# EAGLE design pentabug (EAGLE 6.2)
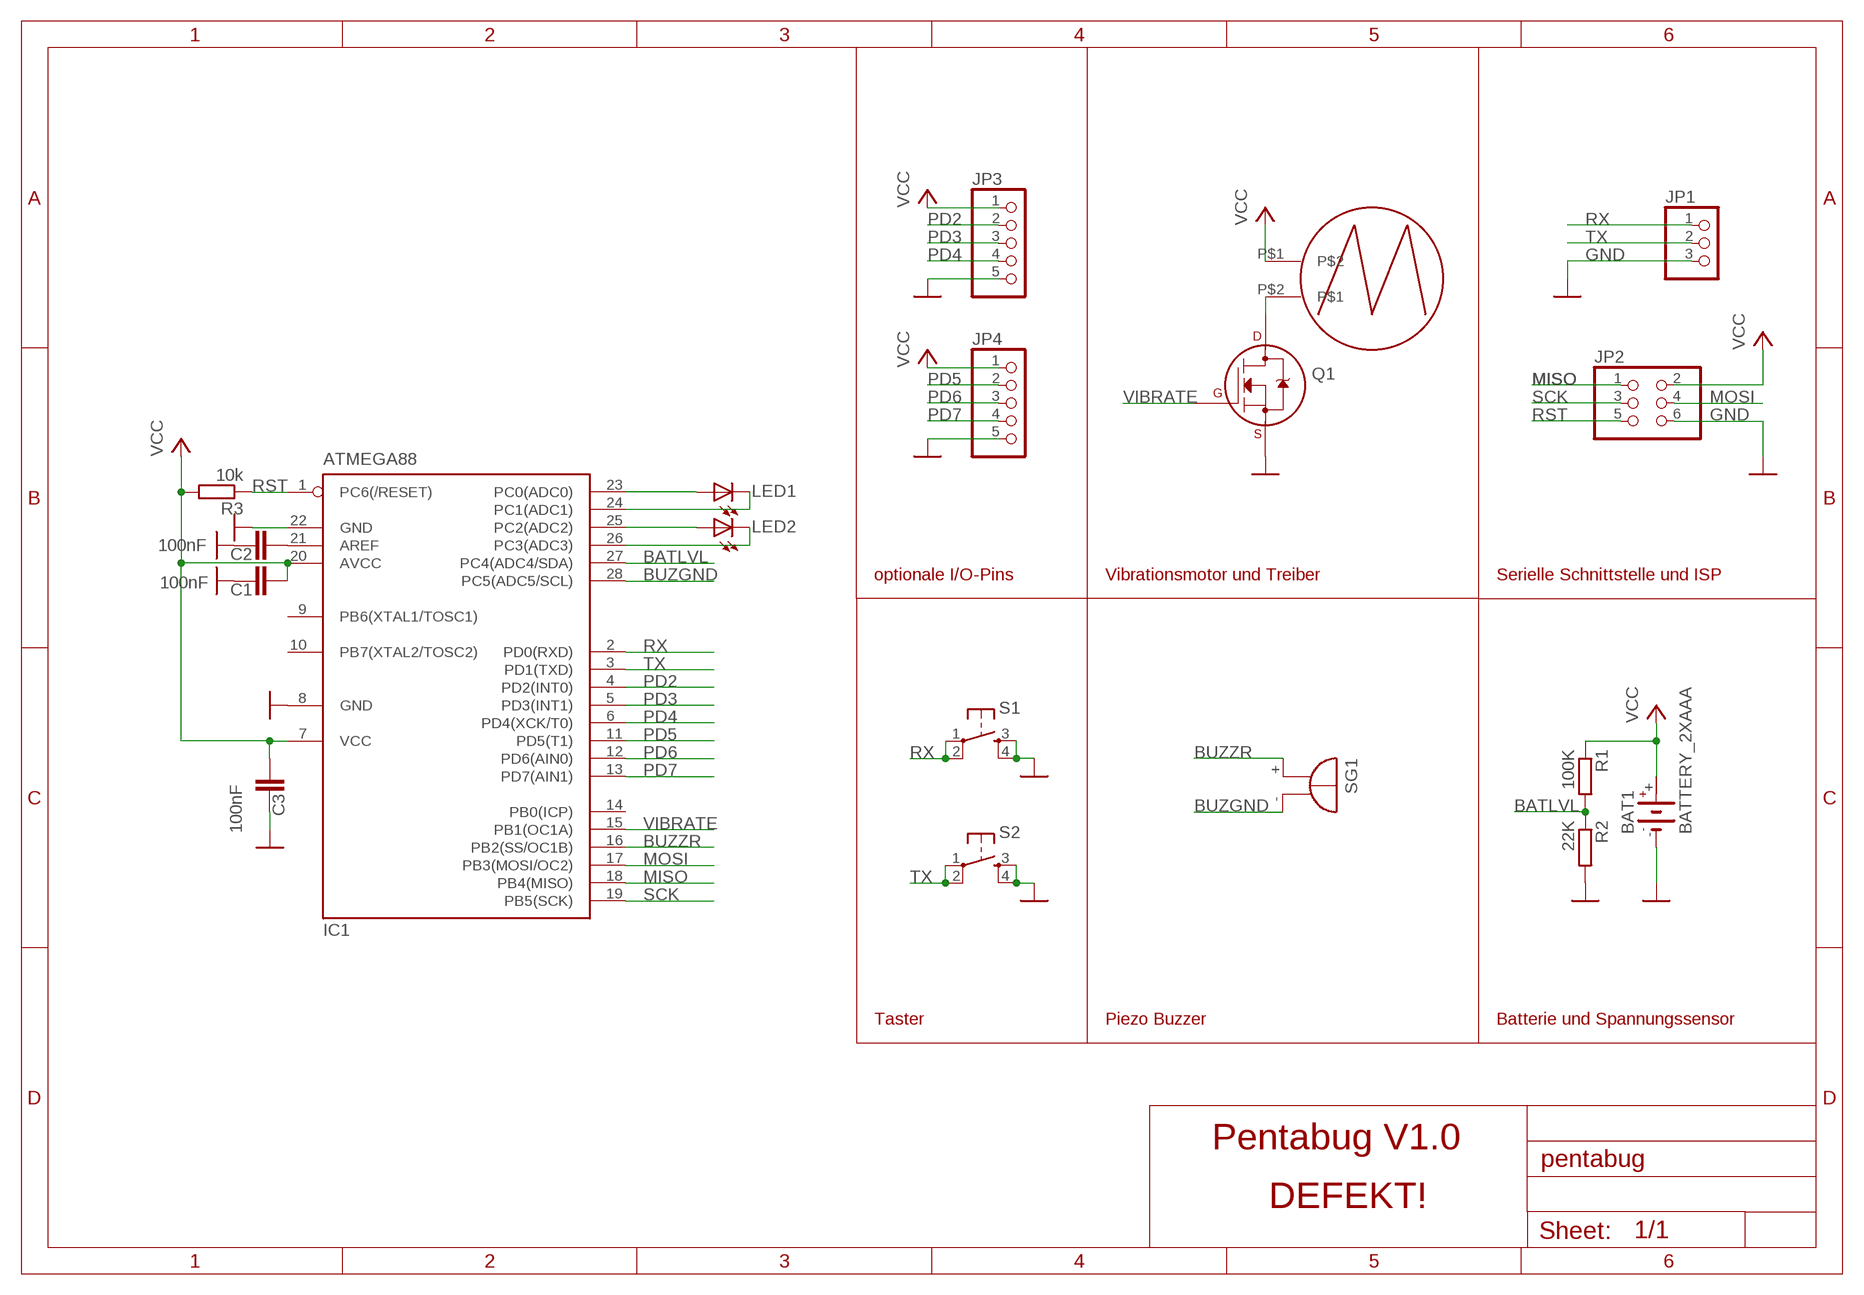
[diagram p0: schematic, sheet 1]

## Parts
BAT1  BATTERY_2XAAA  [BATTERY_2XAAA]
C1  100nF  C-EU025-024X044  [C025-024X044]
C2  100nF  C-EU025-024X044  [C025-024X044]
C3  100nF  C-EU025-024X044  [C025-024X044]
IC1  ATMEGA88  MEGA8-P  [DIL28-3]
JP1  PINHD-1X3  [1X03]
JP2  PINHD-2X3  [2X03]
JP3  PINHD-1X5  [1X05]
JP4  PINHD-1X5  [1X05]
LED1  LED5MM  [LED5MM]
LED2  LED5MM  [LED5MM]
Q1  2N7000_TO92  [TO-92]
R1  100K  R-EU_0207/10  [0207/10]
R2  22K  R-EU_0207/10  [0207/10]
R3  10k  R-EU_0207/10  [0207/10]
S1  TAC_SWITCHPTH  [TACTILE-PTH]
S2  TAC_SWITCHPTH  [TACTILE-PTH]
SG1  MULTIBUZZRTDKBUZZR  [BUZZRTDK]
U$1  VIBRAMOTOR  [LA4-432]

## Nets
BATLVL: IC1.27(PC4(ADC4/SDA)) R1.2 R2.1
BATTLVL: IC1.26(PC3(ADC3)) LED2.K(C)
BUZGND: IC1.28(PC5(ADC5/SCL)) SG1.-
BUZZR: IC1.16(PB2(SS/OC1B)) SG1.+
GND: BAT1.- C1.1 C2.1 C3.1 IC1.8(GND) IC1.22(GND) JP1.3 JP2.6 JP3.5 JP4.5 Q1.1(S) R2.2 S1.3 S1.4 S2.3 S2.4
MISO: IC1.18(PB4(MISO)) JP2.1
MOSI: IC1.17(PB3(MOSI/OC2)) JP2.4
N$3: IC1.23(PC0(ADC0)) LED1.A
N$5: IC1.25(PC2(ADC2)) LED2.A
N$8: Q1.3(D) U$1.P$2
N$10: IC1.24(PC1(ADC1)) LED1.K(C)
N$17: C2.2 IC1.21(AREF)
PD2: IC1.4(PD2(INT0)) JP3.2
PD3: IC1.5(PD3(INT1)) JP3.3
PD4: IC1.6(PD4(XCK/T0)) JP3.4
PD5: IC1.11(PD5(T1)) JP4.2
PD6: IC1.12(PD6(AIN0)) JP4.3
PD7: IC1.13(PD7(AIN1)) JP4.4
RST: IC1.1(PC6(/RESET)) JP2.5 R3.1
RX: IC1.2(PD0(RXD)) JP1.1 S1.1 S1.2
SCK: IC1.19(PB5(SCK)) JP2.3
TX: IC1.3(PD1(TXD)) JP1.2 S2.1 S2.2
VCC: BAT1.+ C1.2 C3.2 IC1.7(VCC) IC1.20(AVCC) JP2.2 JP3.1 JP4.1 R1.1 R3.2 U$1.P$1
VIBRATE: IC1.15(PB1(OC1A)) Q1.2(G)
Unconnected: IC1.9(PB6(XTAL1/TOSC1)) IC1.10(PB7(XTAL2/TOSC2)) IC1.14(PB0(ICP))

## Notes on the sheet
- optionale I/O-Pins | Vibrationsmotor und Treiber | Serielle Schnittstelle und ISP
- Taster | Piezo Buzzer | Batterie und Spannungssensor
- Pentabug V1.0
- DEFEKT!

## Library data of the parts
BAT1 = seb:BATTERY_2XAAA: Farnell Battery Holder 2x AAA Farnell # 1650679
C1-C3 = resistor:C-EU: CAPACITOR, European symbol
IC1 = atmel:MEGA8-P: MICROCONTROLLER 8 Kbytes FLASH, 1 kbytes SRAM, 512 bytes EEPROM, USART, 4-channel 10 bit ADC, 2-channel 8 bit ADC Pin compatible with Atmega48, ATMega88, ATMega168 Source: avr.lbr; OC_FARNELL: unknown; OC_NEWARK: unknown
JP1 = pinhead:PINHD-1X3: PIN HEADER
JP2 = pinhead:PINHD-2X3: PIN HEADER
JP3 JP4 = pinhead:PINHD-1X5: PIN HEADER
LED1 LED2 = SparkFun:LED: LEDs Standard schematic elements and footprints for 5mm, 3mm, 1206, and 0603 sized LEDs. 5mm - Spark Fun Electronics SKU : COM-00529 (and others)
Q1 = transistors:2N700*: 2N7000, 2N7002, NDS7002A N-channel enhancement mode MOSFET
R1-R3 = rcl:R-EU_: RESISTOR, European symbol
S1 S2 = SparkFun:TAC_SWITCH: Momentary Switch Button commonly used for reset or general input. Spark Fun Electronics SKU : COM-00097
SG1 = buglbr:MULTIBUZZR: BUZZER TDK PS1720P02 http://de.mouser.com/ProductDetail/TDK/PS1720P02/?qs=%2fha2pyFadujtCAfY3DKBdXuzQLwQogEgrqwqrrNaKDmjrMwApyDRCA%3d%3d
U$1 = buglbr:VIBRAMOTOR

## Board
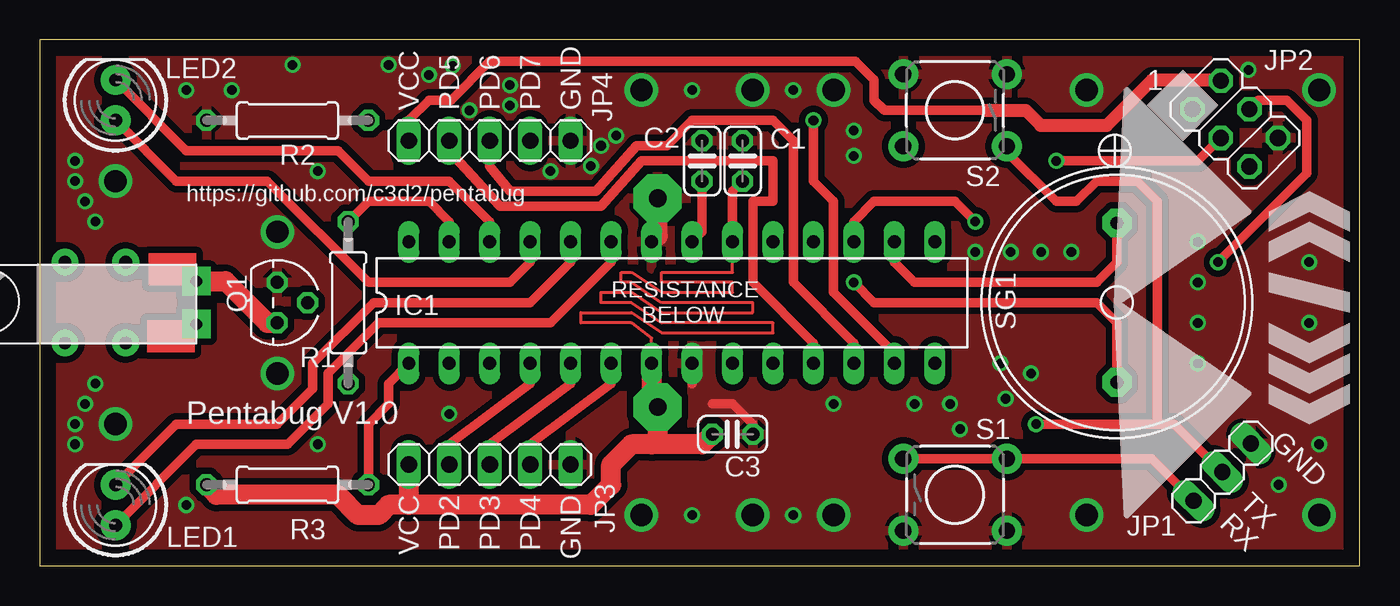
[diagram p1: board, top side]
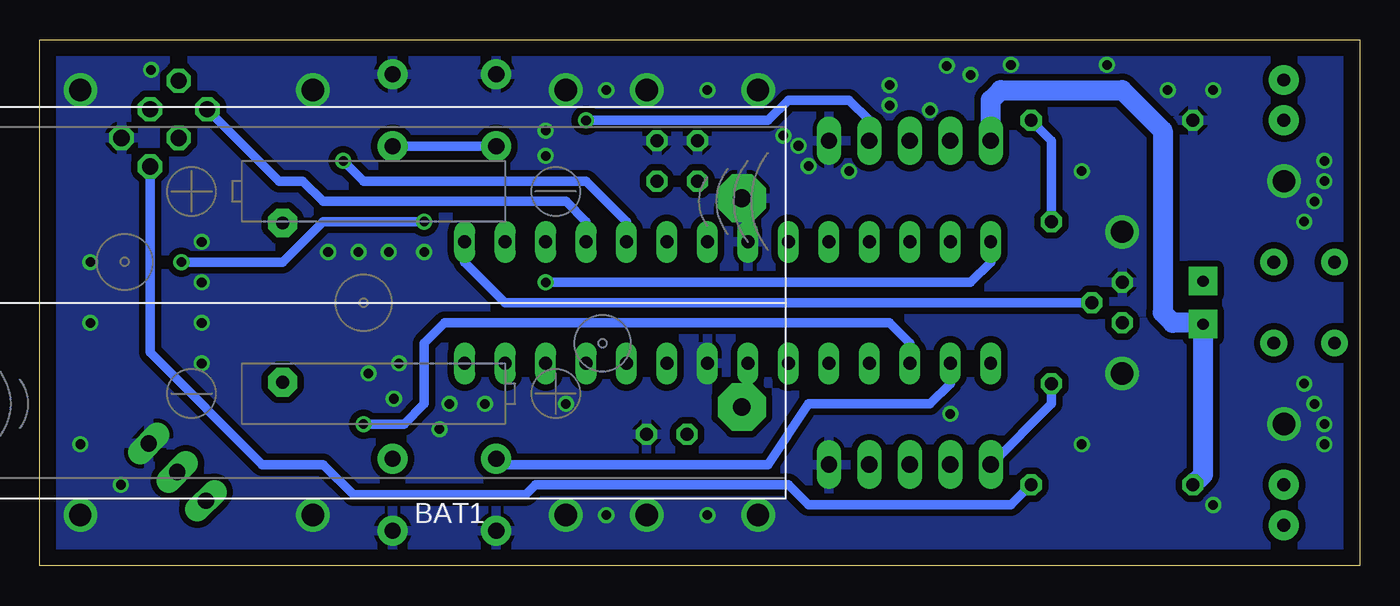
[diagram p2: board, bottom side, seen from below]

Size 82.85 x 33 mm. Coordinates in mm from the lower left corner, seen from the top.
Outline: 82.85,0 82.85,33 0,33 0,0 82.85,0
Copper layers (1*16): Top 0.035mm / dielectric 1.5mm / Bottom 0.035mm
Design rules: minimum track width 8mil, minimum drill 0.6mm, track to track 8mil, track to pad 8mil, pad to pad 8mil, via to via 8mil, smd to smd 8mil, copper to edge 40mil, drill to drill 8mil, minimum pad ring 10mil, minimum via ring 8mil, stop-mask expansion 4mil, vias tented up to drill 0.8mm, thermal gap 10mil

### Footprints (pad centres in the part's own frame; a part is rotated, then mirrored left to right if it is on the bottom)
BATTERY_2XAAA = drill 1.1 pad 3 octagon: + -23.75,6.55; - -23.75,-6.55
C025-024X044 = drill 0.813 octagon: 1 -1.27,0; 2 1.27,0
DIL28-3 = drill 0.813 long: 1 -16.51,-3.81; 2 -13.97,-3.81; 3 -11.43,-3.81; 4 -8.89,-3.81; 5 -6.35,-3.81; 6 -3.81,-3.81; 7 -1.27,-3.81; 8 1.27,-3.81; 9 3.81,-3.81; 10 6.35,-3.81; 11 8.89,-3.81; 12 11.43,-3.81; 13 13.97,-3.81; 14 16.51,-3.81; 15 16.51,3.81; 16 13.97,3.81; 17 11.43,3.81; 18 8.89,3.81; 19 6.35,3.81; 20 3.81,3.81; 21 1.27,3.81; 22 -1.27,3.81; 23 -3.81,3.81; 24 -6.35,3.81; 25 -8.89,3.81; 26 -11.43,3.81; 27 -13.97,3.81; 28 -16.51,3.81
1X03 = drill 1.016 long: 1 -2.54,0; 2 0,0; 3 2.54,0
2X03 = drill 1.016 octagon: 1 -2.54,-1.27; 2 -2.54,1.27; 3 0,-1.27; 4 0,1.27; 5 2.54,-1.27; 6 2.54,1.27
1X05 = drill 1.016 long: 1 -5.08,0; 2 -2.54,0; 3 0,0; 4 2.54,0; 5 5.08,0
LED5MM = drill 0.813 pad 1.88: A -1.27,0; K 1.27,0
TO-92 = drill 0.813 octagon: 1 -1.27,0; 2 0,1.905; 3 1.27,0
0207/10 = drill 0.813 octagon: 1 -5.08,0; 2 5.08,0
TACTILE-PTH = drill 1.016 pad 1.88: 1 -3.251,2.261; 2 3.251,2.261; 3 -3.251,-2.261; 4 3.251,-2.261
BUZZRTDK = drill 0.8 pad 1.8 octagon: + 5,0; - -5,0
LA4-432 = drill 0.7 pad 1.778 square: P$1 -6.985,1.35; P$2 -6.985,-1.35

### Placement (x,y rotation side)
BAT1  62.53,16.51 180 bottom
C1  44.12,25.4 270 top
C2  41.58,25.4 270 top
C3  43.48,8.26 180 top
IC1  39.67,16.51 0 top
JP1  74.22,5.88 45 top
JP2  75.03,27.74 315 top
JP3  28.25,6.35 0 top
JP4  28.25,26.67 0 top
LED1  4.75,3.81 90 top
LED2  4.75,29.21 90 top
Q1  14.91,16.51 270 top
R1  19.36,16.51 90 top
R2  18K  [0207/10]  15.55,27.94 180 top
R3  15.55,5.08 180 top
S1  57.45,4.45 0 top
S2  57.45,28.57 180 top
SG1  67.61,16.51 90 top
U$1  2.85,16.51 180 top

### Tracks (layer width: path | path; a pad name or v marks a point on that pad's centre or on a via)
BATLVL
  Top 0.61: IC1.27 25.71,21.59 24.43,22.86 20.62,22.86 R1.2
  Bottom 0.61: R2.1 19.36,26.67 R1.2
BATTLVL
  Top 0.61: IC1.26 28.25,21.59 25.71,24.13 20.62,24.13 18.72,26.04 9.2,26.04 LED2.K
BUZGND  (via drill 0.6)
  Top 0.61: v51.1,17.78 52.38,16.51 66.34,16.51 67.61,15.24 SG1.-
  Bottom 0.61: IC1.28 23.16,19.05 24.43,17.78 v51.1,17.78
BUZZR
  Top 0.61: IC1.16 53.64,19.05 54.91,17.78 66.34,17.78 67.61,19.05 SG1.+
GND  (via drill 0.6, 1.4)
  Top 0.61: IC1.8 40.94,11.43 | 42.21,10.16 43.48,10.16 44.75,8.89 C3.1
  Top 1.27: IC1.22 38.78,20.7 BAT1.-
  other vias: 77.77,5.08 80.31,7.62 79.68,15.24 79.68,19.05 72.69,12.7 72.69,15.24 72.69,17.78 72.69,20.32 9.2,3.81 2.21,7.62 2.21,8.89 2.85,10.16 3.48,11.43 2.21,25.4 2.21,24.13 2.85,22.86 3.48,21.59 17.45,7.62 25.71,9.53 17.45,24.77 25.91,31.37 29.52,28.89 40.94,29.84 47.29,29.84 40.94,3.17 47.29,3.17 75.87,31.11 4.75,8.89 4.75,24.13 37.77,3.17 44.75,3.17 49.83,3.17 65.71,3.17 80.31,3.17 80.31,29.84 65.71,29.84 44.75,29.84 49.83,29.84 37.77,29.84 14.91,20.95 14.91,12.06 49.83,10.16 54.91,10.16 32.05,24.77 34.59,25.08 35.23,26.35 36.18,26.99 24.43,30.8 21.89,31.43 26.98,28.57 29.52,30.16 9.2,29.84 12.05,29.84 51.1,27.3 51.1,25.72 58.72,19.68 64.76,19.68 62.85,19.68 60.95,19.68 57.14,10.16 57.77,8.57 60.63,10.48 60.31,12.7 62.22,12.06 15.86,31.43
  pour Top (isolate 0.406): -0.96,-1.27 -0.96,34.29 84.12,34.29 84.12,-1.27
  pour Bottom (isolate 0.406): -0.96,-1.27 -0.96,34.29 84.12,34.29 84.12,-1.27
  pour Bottom (no thermals): 40.94,13.97 40.94,10.16 42.21,10.16 42.21,13.97
  pour Top (no thermals): 40.94,13.97 40.94,10.16 42.21,10.16 42.21,13.97
MISO
  Bottom 0.61: IC1.18 48.56,21.59 49.83,22.86 65.08,22.86 66.34,24.13 67.83,24.13 JP2.1
MOSI  (via drill 0.6)
  Top 0.61: v58.72,21.59 57.45,22.86 52.38,22.86 51.1,21.59 IC1.17 | JP2.4 76.5,29.21 78.27,29.21 79.53,27.94 79.53,24.62 v73.97,19.05
  Bottom 0.61: v58.72,21.59 65.08,21.59 67.61,19.05 v73.97,19.05
N$1  (via drill 0.8 pad 1.68)
  other vias: 1.58,19.05
N$2  (via drill 0.8 pad 1.68)
  other vias: 5.38,19.05
N$3
  Top 0.61: LED1.A 9.83,7.62 15.55,7.62 18.09,10.16 18.09,12.06 21.26,15.24 32.05,15.24 35.86,19.05 IC1.23
N$4  (via drill 0.8 pad 1.68)
  other vias: 5.38,13.97
N$5
  Top 0.61: LED2.A 8.56,24.13 14.28,24.13 20.62,17.78 29.52,17.78 30.79,19.05 IC1.25
N$6  (via drill 0.8 pad 1.68)
  other vias: 1.58,13.97
N$8
  Top 1.27: U$1.P$2 11.65,17.86 14.28,15.24 Q1.3
N$10
  Top 0.61: IC1.24 33.32,19.05 30.79,16.51 20.94,16.51 17.13,12.7 17.13,11.11 14.91,8.89 8.56,8.89 LED1.K
N$17
  Top 0.61: IC1.21 41.58,20.95 C2.2
PD2
  Top 0.61: JP3.2 25.71,7.62 30.79,11.43 IC1.4
PD3
  Top 0.61: JP3.3 28.25,7.62 33.32,11.43 IC1.5
PD4
  Top 0.61: IC1.6 35.86,11.43 30.79,7.62 JP3.4
PD5
  Top 0.61: IC1.11 48.56,13.97 44.75,17.78 44.75,22.86 46.02,22.86 46.02,25.4 37.77,25.4 35.23,22.54 28.88,22.54 25.71,26.04 JP4.2
PD6
  Top 0.61: IC1.12 51.1,13.97 47.29,17.78 47.29,26.67 46.02,27.94 40.94,27.94 39.36,26.35 37.45,26.35 34.91,23.5 29.52,23.5 28.25,25.08 JP4.3
PD7  (via drill 0.6)
  Top 0.61: IC1.13 53.64,13.34 49.83,17.14 49.83,22.86 48.56,24.13 v48.56,27.94
  Bottom 0.61: v48.56,27.94 37.13,27.94 35.86,29.21 32.05,29.21 30.79,27.94 JP4.4
RST
  Top 0.61: IC1.1 21.89,11.43 21.89,10.16 20.62,8.89 R3.1
  Bottom 0.61: R3.1 21.89,3.81 34.59,3.81 35.86,5.08 51.74,5.08 52.38,4.45 63.17,4.45 65.08,6.35 68.88,6.35 75.93,13.4 JP2.5
RX
  Top 0.61: S1.1 S1.2 69.8,6.71 JP1.1
  Bottom 0.61: IC1.2 25.71,11.43 26.98,10.16 34.59,10.16 37.13,6.35 53.85,6.35 S1.1
SCK  (via drill 0.6)
  Top 0.61: v63.8,25.4 72.69,25.4 JP2.3
  Bottom 0.61: IC1.19 46.02,21.59 48.56,24.13 62.53,24.13 v63.8,25.4
TX  (via drill 0.6)
  Top 0.61: JP1.2 71.21,8.89 70.16,8.89 | 70.16,8.89 v62.53,8.89 | S2.1 60.71,25.96 63.8,22.86 65.08,22.86 66.34,24.13 68.88,24.13 70.16,22.86 70.16,8.89
  Top 0.914: JP1.2 74.44,5.88
  Bottom 0.61: IC1.3 28.25,13.97 29.52,15.24 57.45,15.24 58.72,13.97 58.72,10.16 59.99,8.89 v62.53,8.89 | S2.2 S2.1
VCC
  Top 0.203: IC1.7 38.4,14.29 37.13,15.24 33.96,15.24 33.96,15.88 37.13,15.88 39.04,14.61 46.02,14.61 46.02,15.24 39.04,15.24 37.13,16.51 35.23,16.51 35.23,17.14 37.13,17.14 39.04,15.88 44.75,15.88 44.75,16.51 39.04,16.51 37.13,17.78 36.5,17.78 36.5,18.41 37.13,18.41 39.04,17.14 43.48,17.14 43.48,17.78 39.04,17.78 39.04,18.41 43.48,18.41 IC1.20
  Top 0.61: IC1.20 43.48,23.5 C1.2 | JP4.1 23.16,27.94 24.43,29.21 25.8,29.21 28.25,31.65 51.2,31.65 52.38,30.48 52.38,29.21 53.01,28.57 59.36,28.57
  Top 0.813: 59.36,28.57 61.9,28.57 62.84,27.64 66.98,27.64 69.83,30.48 74.09,30.48 JP2.2
  Top 1.27: IC1.7 38.4,10.34 BAT1.+ 38.78,8 38.4,7.62 | 23.16,3.81 34.59,3.81 35.86,5.08 35.86,6.35 37.13,7.62 38.4,7.62 | JP3.1 23.16,3.81 | 23.16,3.81 21.89,3.81 21.26,3.17 19.99,3.17 18.72,4.45 11.1,4.45 R3.2 | C3.2 41.58,7.62 38.4,7.62
  Bottom 0.61: R1.1 19.36,10.16 JP3.1
  Bottom 1.27: R3.2 9.83,5.71 U$1.P$1 9.91,15.24 11.73,15.24 12.37,15.88 12.37,27.3 14.91,29.84 22.53,29.84 23.16,29.21 JP4.1
VIBRATE
  Bottom 0.61: Q1.2 53.64,16.51 56.18,19.05 IC1.15

### Text on the board
tNames: 1 | VCC | PD5 | PD6 | PD7 | GND | https://github.com/c3d2/pentabug | RESISTANCE | BELOW | Pentabug V1.0 | GND | VCC | PD2 | PD3 | PD4 | GND | TX | RX
bStop: Pentabug V1.0 | https://github.com/c3d2/pentabug